# Altium schematic sheet 52204 Breakout.SchDoc
size B
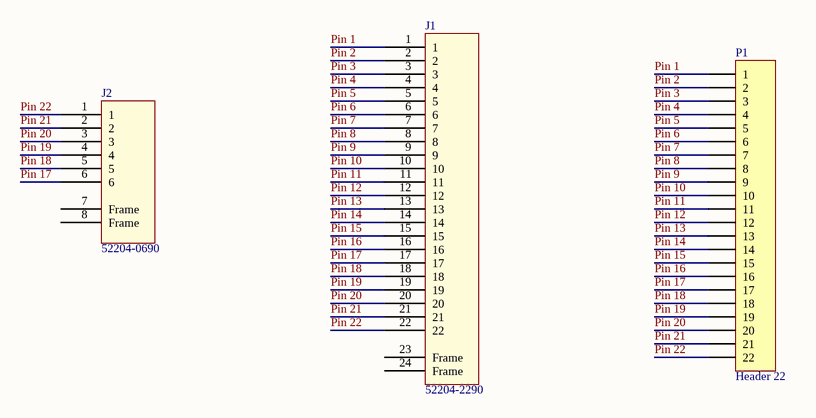
[diagram p0: 52204 Breakout.SchDoc]

## Parts
J1  52204-2290  [52204-2290]
J2  52204-0690  [52204-0690]
P1  Header 22  [HDR1X22]

## Nets
Pin 1: J1.1 P1.1
Pin 2: J1.2 P1.2
Pin 3: J1.3 P1.3
Pin 4: J1.4 P1.4
Pin 5: J1.5 P1.5
Pin 6: J1.6 P1.6
Pin 7: J1.7 P1.7
Pin 8: J1.8 P1.8
Pin 9: J1.9 P1.9
Pin 10: J1.10 P1.10
Pin 11: J1.11 P1.11
Pin 12: J1.12 P1.12
Pin 13: J1.13 P1.13
Pin 14: J1.14 P1.14
Pin 15: J1.15 P1.15
Pin 16: J1.16 P1.16
Pin 17: J1.17 J2.6 P1.17
Pin 18: J1.18 J2.5 P1.18
Pin 19: J1.19 J2.4 P1.19
Pin 20: J1.20 J2.3 P1.20
Pin 21: J1.21 J2.2 P1.21
Pin 22: J1.22 J2.1 P1.22

Not connected (* = marked no-connect by the designer): J1 23(Frame) 24(Frame); J2 7(Frame) 8(Frame)

## Library data of the parts
P1 = Header 22: Header, 22-Pin; LatestRevisionDate: 17-Jul-2002; LatestRevisionNote: Re-released for DXP Platform.; Publisher: Altium Limited